# Altium schematic sheet STM32.SchDoc
size A; SheetNumber: 4; SheetTotal: 5
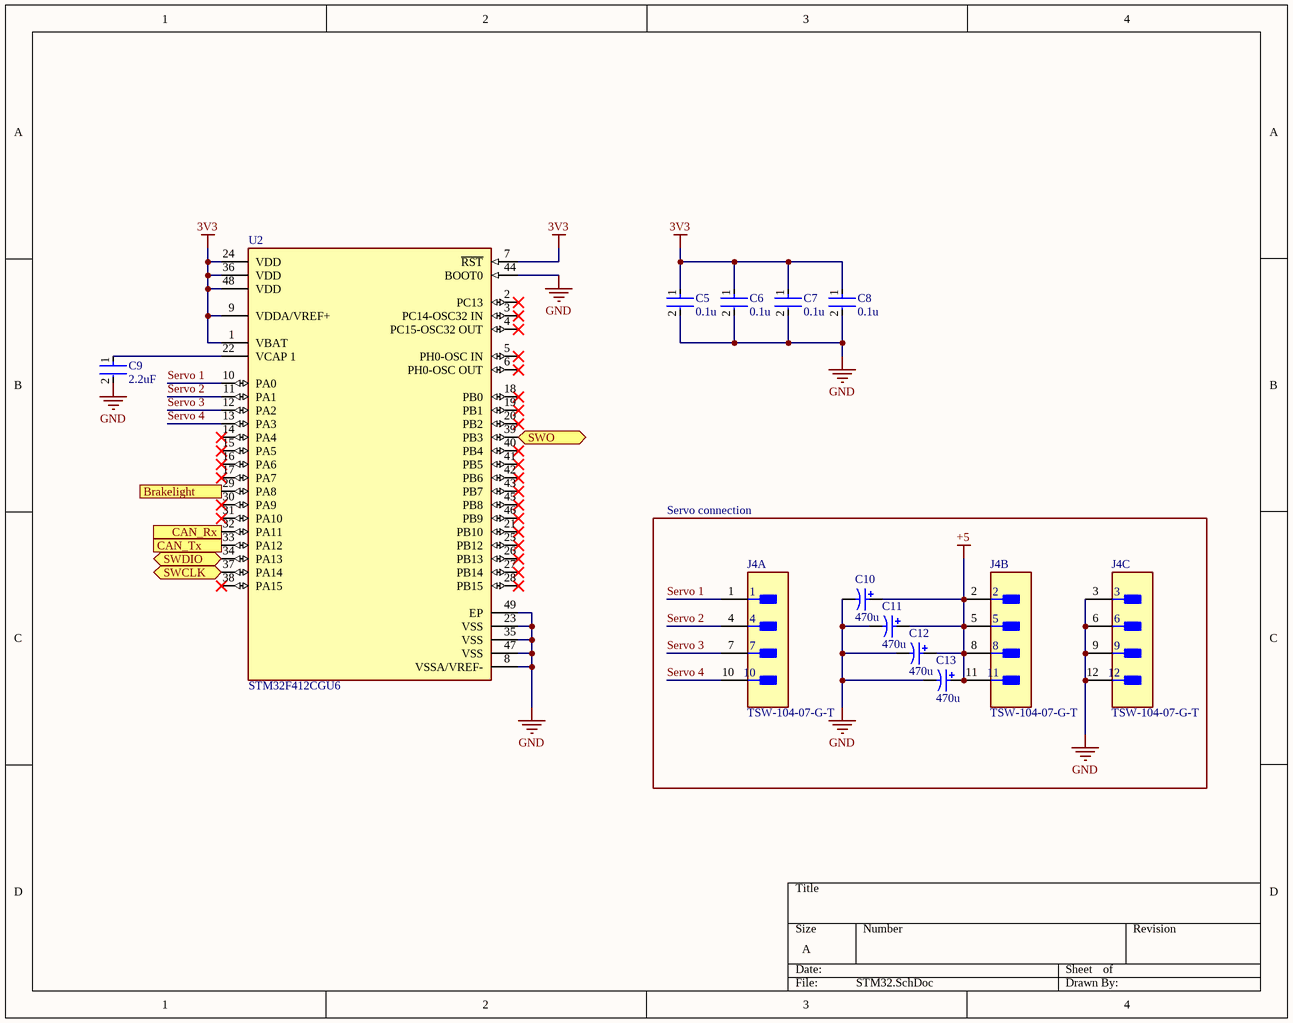
[diagram p0: STM32.SchDoc]

## Parts
C5  0.1u  [FP-C0603C-CF-MFG]
C6  0.1u  [FP-C0603C-CF-MFG]
C7  0.1u  [FP-C0603C-CF-MFG]
C8  0.1u  [FP-C0603C-CF-MFG]
C9  2.2uF  [FP-GRM188-0_1-e0_2_0_5-MFG]
C10  470u  [PNSC-FP-V-G_V]
C11  470u  [PNSC-FP-V-G_V]
C12  470u  [PNSC-FP-V-G_V]
C13  470u  [PNSC-FP-V-G_V]
J4  TSW-104-07-G-T  [FP-TSW-104-07-G-T-MFG]  (parts A,B,C of 3)
U2  STM32F412CGU6  [FP-UFQFPN48-A0B9-MFG]

## Blocks framed on the sheet
Servo connection: C10-C13 J4

## Ports
Brakelight (out), CAN_Rx (in), CAN_Tx (out), SWCLK (bidir), SWDIO (bidir), SWO (bidir)

## Nets
3V3: C5.1 C6.1 C7.1 C8.1 U2.1(VBAT) U2.7(~{RST}) U2.9(VDDA/VREF+) U2.24(VDD) U2.36(VDD) U2.48(VDD)
+5: C10.1 C11.1 C12.1 C13.1 J4.2 J4.5 J4.8 J4.11
GND: C5.2 C6.2 C7.2 C8.2 C9.2 C10.2 C11.2 C12.2 C13.2 J4.3 J4.6 J4.9 J4.12 U2.8(VSSA/VREF-) U2.23(VSS) U2.35(VSS) U2.44(BOOT0) U2.47(VSS) U2.49(EP)
Brakelight: U2.29(PA8) ; port Brakelight
CAN_Rx: U2.32(PA11) ; port CAN_Rx
CAN_Tx: U2.33(PA12) ; port CAN_Tx
Servo 1: J4.1 U2.10(PA0)
Servo 2: J4.4 U2.11(PA1)
Servo 3: J4.7 U2.12(PA2)
Servo 4: J4.10 U2.13(PA3)
SWCLK: U2.37(PA14) ; port SWCLK
SWDIO: U2.34(PA13) ; port SWDIO
SWO: U2.39(PB3) ; port SWO
NetC9_1: C9.1 U2.22(VCAP_1)

Not connected (* = marked no-connect by the designer): U2 2(PC13)* 3(PC14-OSC32_IN)* 4(PC15-OSC32_OUT)* 5(PH0-OSC_IN)* 6(PH0-OSC_OUT)* 14(PA4)* 15(PA5)* 16(PA6)* 17(PA7)* 18(PB0)* 19(PB1)* 20(PB2)* 21(PB10)* 25(PB12)* 26(PB13)* 27(PB14)* 28(PB15)* 30(PA9)* 31(PA10)* 38(PA15)* 40(PB4)* 41(PB5)* 42(PB6)* 43(PB7)* 45(PB8)* 46(PB9)*

## Library data of the parts
C5-C8 = CMP-2006-03061-2: CAP CER 0.1UF 50V X7R 0603; Manufacturer: KEMET; Manufacturer Part Number: C0603C104K5RACTU; Tolerance: 0.1; Temperature Coefficient: 30ppm/°C; Material: Ceramic; Automotive Grade: Grade 1; Value: 0.10 μF; Temperature: -55°C to +125°C; RoHS: TRUE; Temperature Range High: +125°C; Lead Free: Yes; Octopart: https://octopart.com/c0603c104k5ractu-kemet-139244; Digikey Description: CAP CER 0.1UF 50V X7R 0603; Category: Cap; Package: C0603C-CF; ComponentLink2Description: Datasheet; Temperature Range Low: -55°C; Device Class L1: Passive Components; Voltage Rating: 50 V; Automotive: Yes; Device Class L3: Ceramic Capacitors; ComponentLink2URL: https://api.kemet.com/component-edge/download/datasheet/C0603C100J5GACAUTO.pdf; Capacitance: 0.10 μF; Device Class L2: Capacitors; Temperature Characteristic: X7R; Height: 0.87mm
C9 = CMP-2006-02836-2: Chip Multilayer Ceramic Capacitors for General Purpose, 0603, 2.2uF, X7R, 15%, 10%, 10V; Case Code (Metric): 1608; Height: 0.8mm; Packaging: Cut Tape; Voltage: 10V; Lead Free: Lead Free; Min Operating Temperature: -55°C; Voltage Rating (DC): 10V; Max Operating Temperature: 125°C; Voltage Rating: 10V; Dielectric: X7R; Depth: 0.8mm; Case Code (Imperial): 0603; Termination: SMD/SMT; Case/Package: 0603; Number of Pins: 2; REACH SVHC: No SVHC; Mount: Surface Mount; Width: 0.031inch; Material: Ceramic; Capacitance: 2.2uF; Package Quantity: 1; Weight: 7.1E-05oz; Length: 1.6mm; Thickness: 0.035inch; Tolerance: 10%
C10-C13 = CMP-2000-06214-1: Aluminum Electrolytic Capacitor, 470 uF, +/- 20%, 25 V, 2-Pin SMD (Size Code G), -55 to 105 degC, RoHS, Tape and Reel; Manufacturer: Panasonic; Capacitance: 470µF; Ripple Current: 1190mA; ESR (Equivalent Series Resistance): 0.06O; Type: Can; Rated Voltage: 25V; Lifetime@Temperature: 2000Hrs@105°C; Package Reference: FP-V-G; Case Size/Dimension: Ø10x10.2mm; Mounting Technology: SurfaceMount; Datasheet Version: 03/2016; Datasheet URL: http://industrial.panasonic.com/cdbs/www-data/pdf/RDE0000/ABA0000C1184.pdf; Series: FP; Operating Temp Range: -55to+105°C; Operating Temp-Max: 105°C; Package URL: http://industrial.panasonic.com/cdbs/www-data/pdf/RDE0000/DME0000COL48.pdf; Package Description: 2-Pin Electrolytic Aluminum Capacitor, Body 10.3 x 10.3 mm; Manufacturer URL: http://www.panasonic.com/
J4 = CMP-1024-00347-2: CONN HEADER VERT 12POS 2.54MM; Manufacturer: Samtec; Conn Orientation: Straight; Number Of Contacts: 12; Conn Gender: Male; Automotive: No; RoHS: TRUE; Number Of Rows: 3; Footprint Url: http://suddendocs.samtec.com/prints/tsw-xxx-xx-x-x-xx-xxx-footprint.pdf; Manufacturer Part Number: TSW-104-07-G-T; Temperature Range High: +125°C; Device Class L2: Headers and Wire Housings; Digikey Description: CONN HEADER VERT 12POS 2.54MM; Pitch: 2.54mm; Device Class L1: Connectors; Category: Conn; Device Class L3: unset; Octopart: https://octopart.com/tsw-104-07-g-t-samtec-8296723; Package: TSW-104-07-G-T; Lead Free: Yes; Height: 8.64mm; ComponentLink2Description: Datasheet; Contact Material: Gold,Nickel; Temperature Range Low: -55°C; ComponentLink2URL: http://suddendocs.samtec.com/prints/tsw-xxx-xx-xxx-x-xx-xxx-mkt.pdf; Temperature: -55°C to +125°C
U2 = CMP-12105-000086-1: IC MCU 32BIT 1MB FLASH 48UFQFPN; Frequency: 100MHz; Peripherals: Brown-out Detect/Reset; Number of I/Os: 36; Interface: I2C; Core Architecture: ARM; Oscillator Type: Internal; Memory Type: FLASH; Memory Size: 1MB; Min Operating Temperature: -40°C; Max Operating Temperature: 85°C